# EAGLE design AHRS-v1.3 (EAGLE 5.06)

## Sheet 1 of 3
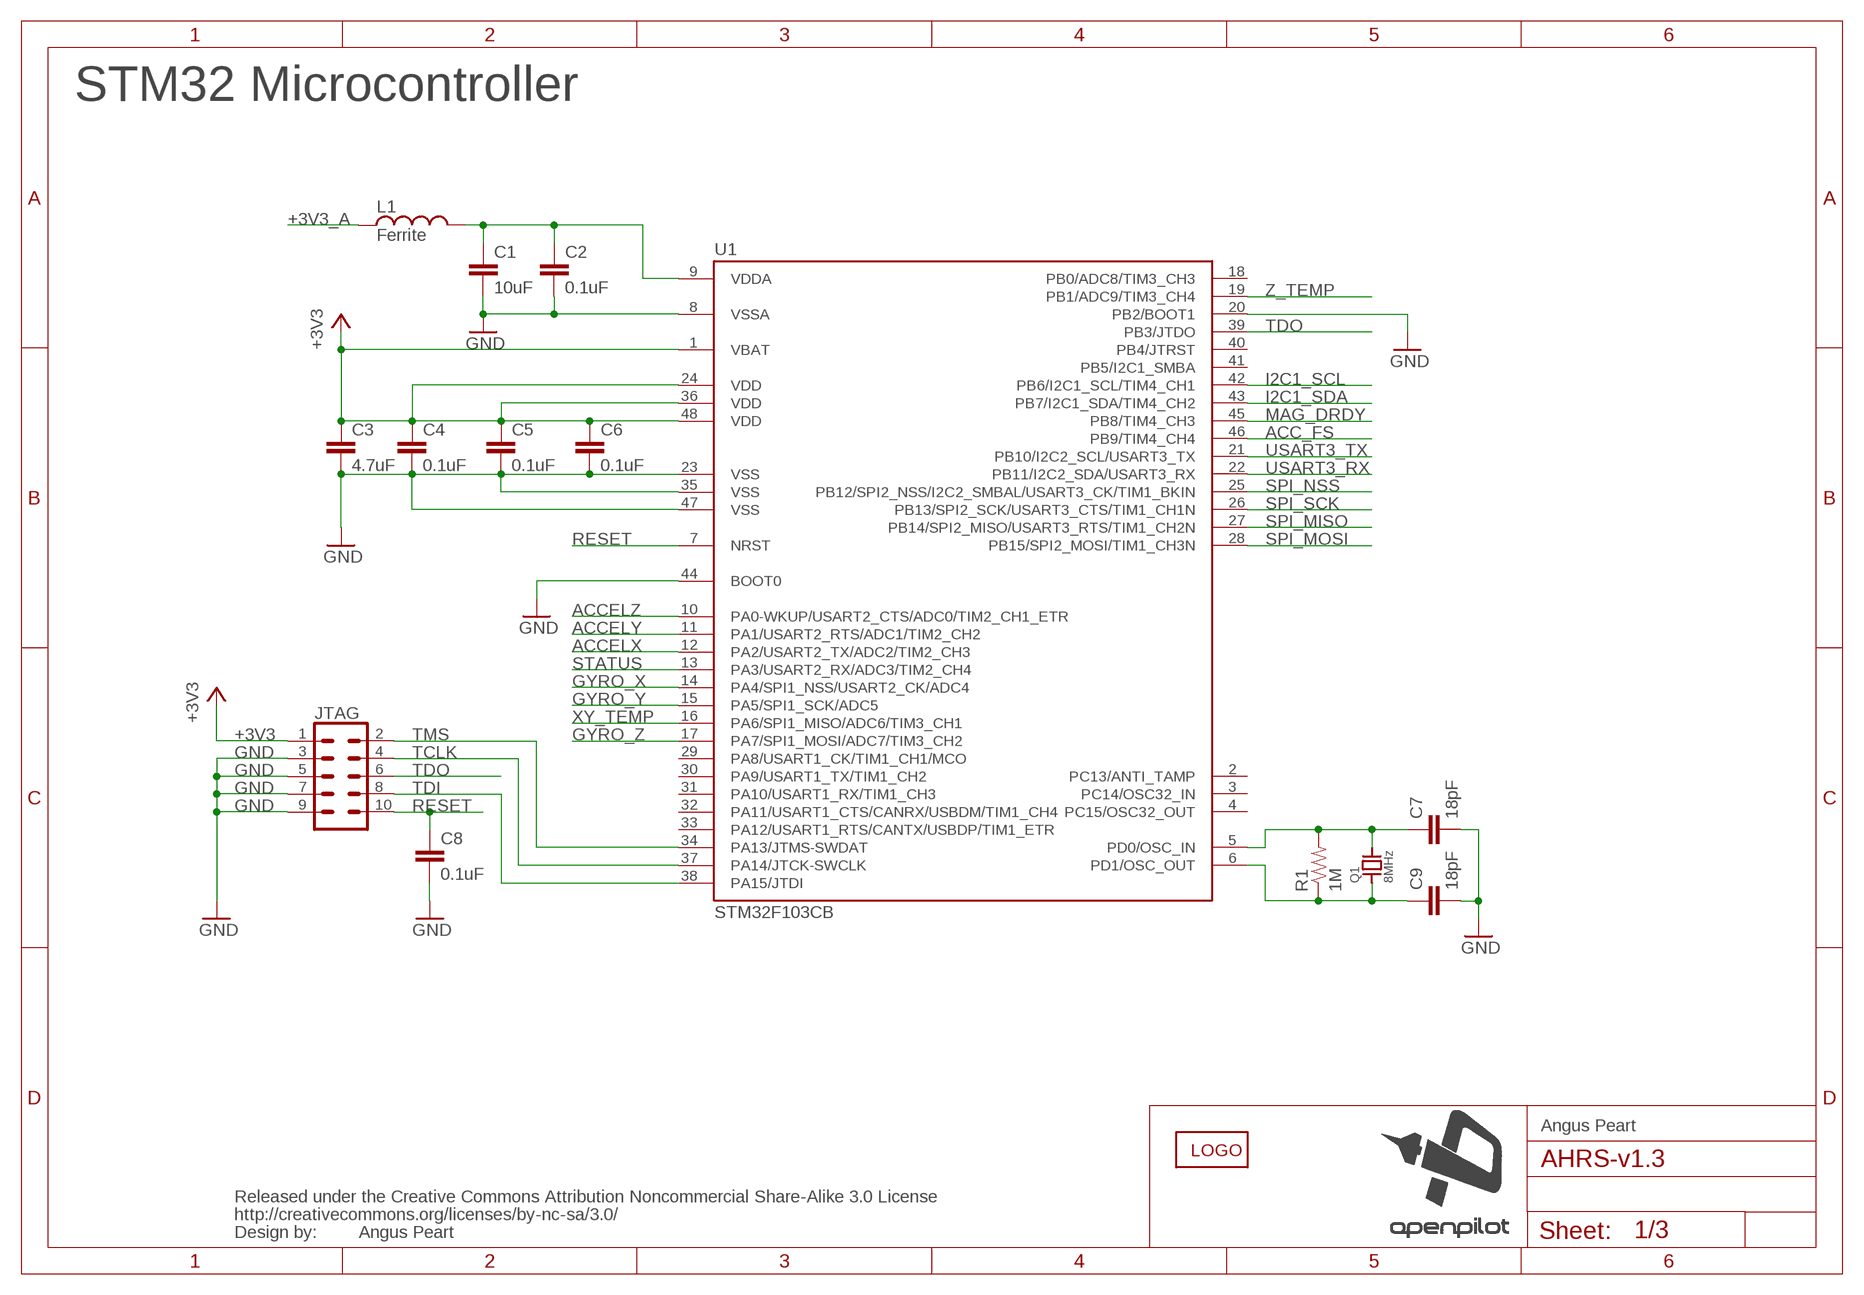
[diagram p0: schematic, sheet 1]

### Parts
C1  10uF  CAPACITOR0805  [0805]
C2  0.1uF  CAPACITOR0603  [0603]
C3  4.7uF  CAPACITOR0805  [0805]
C4  0.1uF  CAPACITOR0603  [0603]
C5  0.1uF  CAPACITOR0603  [0603]
C6  0.1uF  CAPACITOR0603  [0603]
C7  18pF  CAPACITOR0603  [0603]
C8  0.1uF  CAPACITOR0603  [0603]
C9  18pF  CAPACITOR0603  [0603]
CC1  CREATIVE_COMMONS  [CREATIVE_COMMONS]
JTAG  M50-10  [M50-10]
L1  Ferrite  INDUCTOR0603  [0603]
Q1  8MHz  CRYSTAL-5X3  [CRYSTAL-5X3]
R1  1M  RESISTOR0603  [0603]
U1  STM32F103CB  [LQFP48]
U$1  LOGO_BRD_AHRS-BOT  LOGO_BRD_AHRS_BOT  [LOGO-AHRS-BOT]

### Nets
+3V3: C3.1 C4.1 C5.1 C6.1 JTAG.1 U1.1(VBAT) U1.24(VDD) U1.36(VDD) U1.48(VDD) ; also sheet 2,3
+3V3_A: L1.1 ; also sheet 2,3
ACC_FS: U1.46(PB9/TIM4_CH4) ; also sheet 2
ACCELX: U1.12(PA2/USART2_TX/ADC2/TIM2_CH3) ; also sheet 2
ACCELY: U1.11(PA1/USART2_RTS/ADC1/TIM2_CH2) ; also sheet 2
ACCELZ: U1.10(PA0-WKUP/USART2_CTS/ADC0/TIM2_CH1_ETR) ; also sheet 2
GND: C1.2 C2.2 C3.2 C4.2 C5.2 C6.2 C7.2 C8.2 C9.2 JTAG.3 JTAG.5 JTAG.7 JTAG.9 U1.8(VSSA) U1.20(PB2/BOOT1) U1.23(VSS) U1.35(VSS) U1.44(BOOT0) U1.47(VSS) ; also sheet 2,3
GYRO_X: U1.14(PA4/SPI1_NSS/USART2_CK/ADC4) ; also sheet 2
GYRO_Y: U1.15(PA5/SPI1_SCK/ADC5) ; also sheet 2
GYRO_Z: U1.17(PA7/SPI1_MOSI/ADC7/TIM3_CH2) ; also sheet 2
I2C1_SCL: U1.42(PB6/I2C1_SCL/TIM4_CH1) ; also sheet 2
I2C1_SDA: U1.43(PB7/I2C1_SDA/TIM4_CH2) ; also sheet 2
MAG_DRDY: U1.45(PB8/TIM4_CH3) ; also sheet 2
N$4: C7.1 Q1.3 R1.2 U1.5(PD0/OSC_IN)
N$5: C9.1 Q1.1 R1.1 U1.6(PD1/OSC_OUT)
N$16: C1.1 C2.1 L1.2 U1.9(VDDA)
RESET: C8.1 JTAG.10 U1.7(NRST)
SPI_MISO: U1.27(PB14/SPI2_MISO/USART3_RTS/TIM1_CH2N) ; also sheet 3
SPI_MOSI: U1.28(PB15/SPI2_MOSI/TIM1_CH3N) ; also sheet 3
SPI_NSS: U1.25(PB12/SPI2_NSS/I2C2_SMBAL/USART3_CK/TIM1_BKIN) ; also sheet 3
SPI_SCK: U1.26(PB13/SPI2_SCK/USART3_CTS/TIM1_CH1N) ; also sheet 3
STATUS: U1.13(PA3/USART2_RX/ADC3/TIM2_CH4) ; also sheet 3
TCLK: JTAG.4 U1.37(PA14/JTCK-SWCLK)
TDI: JTAG.8 U1.38(PA15/JTDI)
TDO: JTAG.6 U1.39(PB3/JTDO)
TMS: JTAG.2 U1.34(PA13/JTMS-SWDAT)
USART3_RX: U1.22(PB11/I2C2_SDA/USART3_RX) ; also sheet 3
USART3_TX: U1.21(PB10/I2C2_SCL/USART3_TX) ; also sheet 3
XY_TEMP: U1.16(PA6/SPI1_MISO/ADC6/TIM3_CH1) ; also sheet 2
Z_TEMP: U1.19(PB1/ADC9/TIM3_CH4) ; also sheet 2
Unconnected: U1.2(PC13/ANTI_TAMP) U1.3(PC14/OSC32_IN) U1.4(PC15/OSC32_OUT) U1.18(PB0/ADC8/TIM3_CH3) U1.29(PA8/USART1_CK/TIM1_CH1/MCO) U1.30(PA9/USART1_TX/TIM1_CH2) U1.31(PA10/USART1_RX/TIM1_CH3) U1.32(PA11/USART1_CTS/CANRX/USBDM/TIM1_CH4) U1.33(PA12/USART1_RTS/CANTX/USBDP/TIM1_ETR) U1.40(PB4/JTRST) U1.41(PB5/I2C1_SMBA)

### Notes on the sheet
- STM32 Microcontroller
- Angus Peart
- Angus Peart

## Sheet 2 of 3
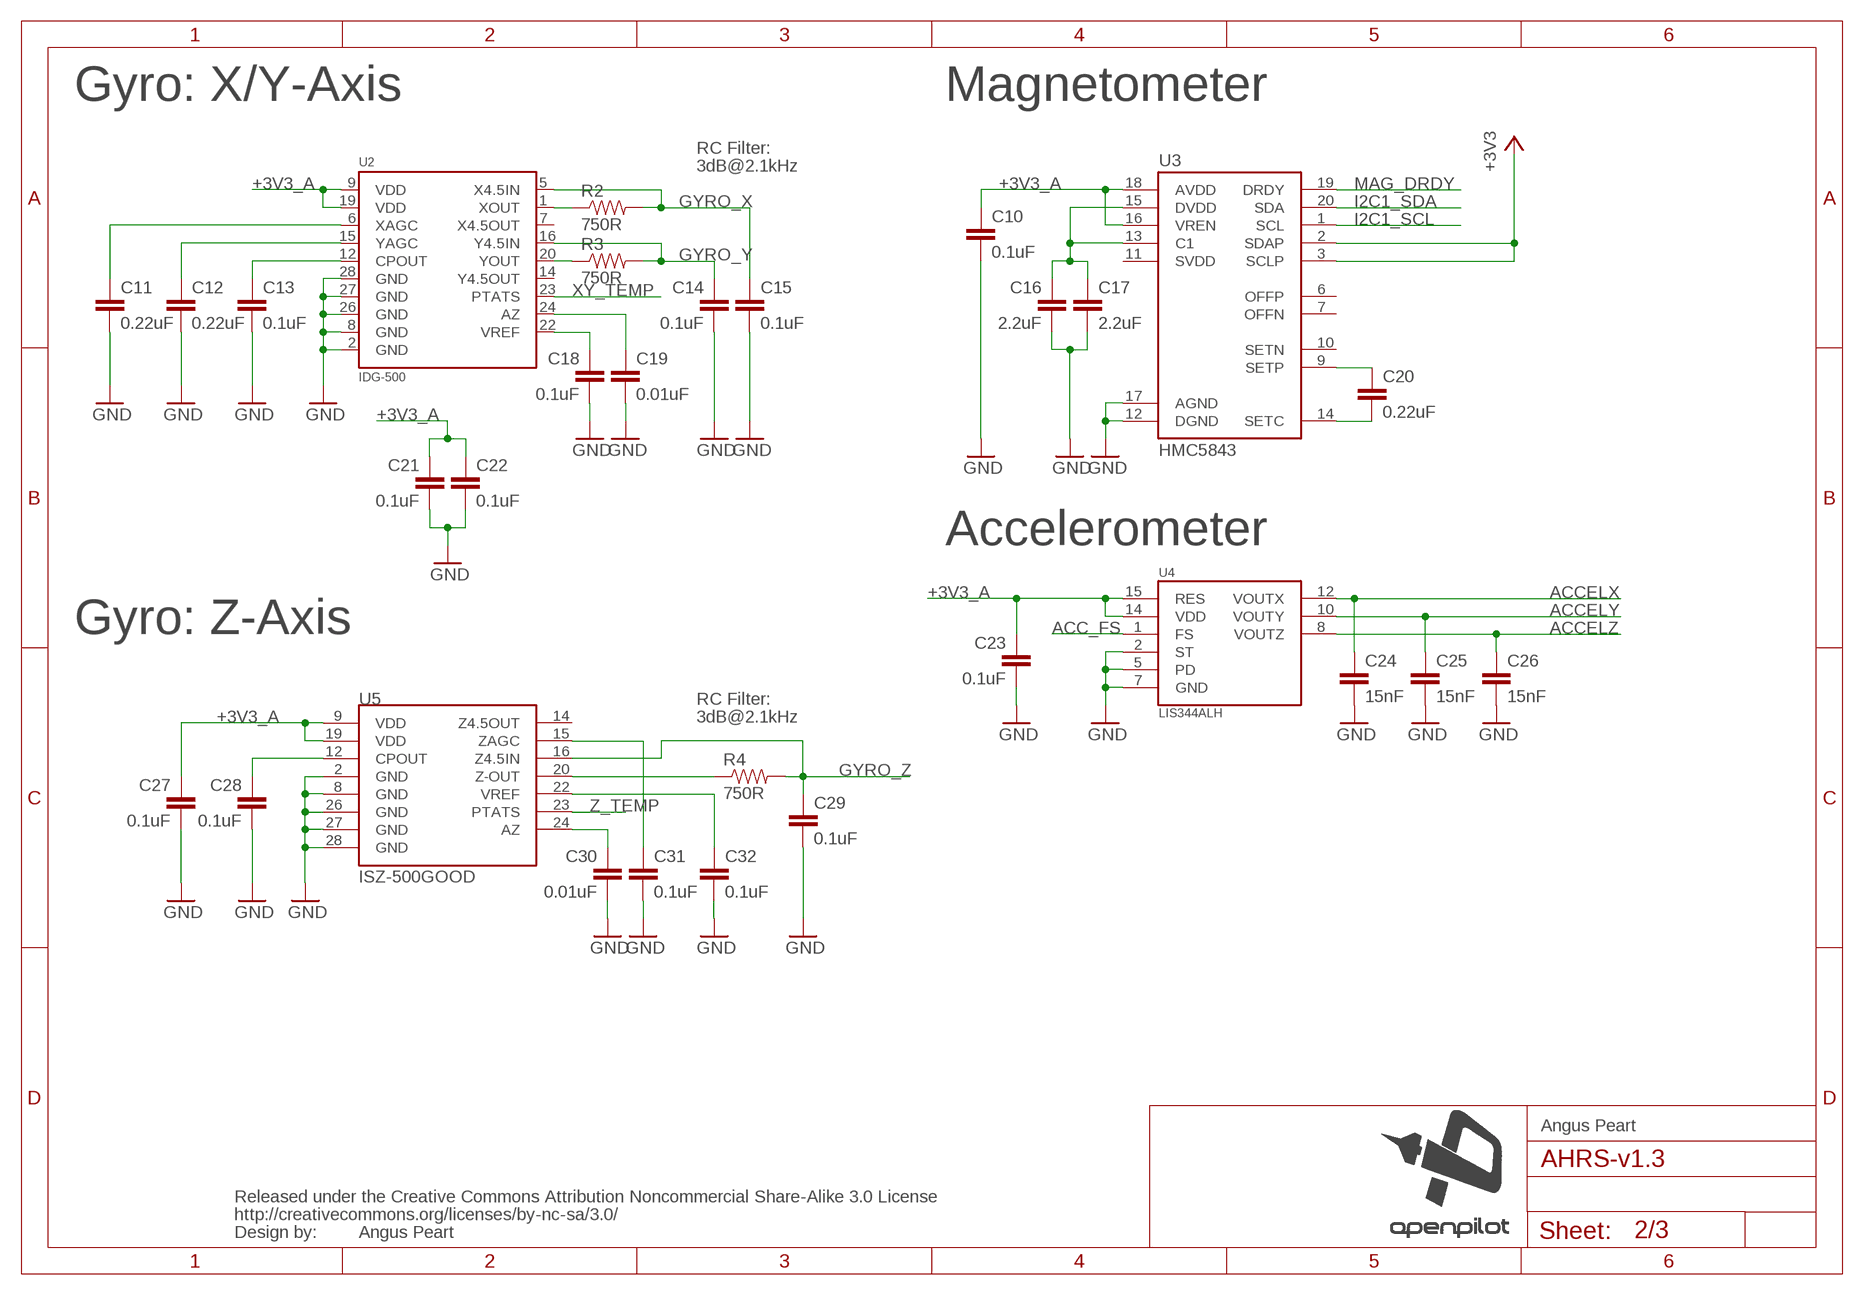
[diagram p1: schematic, sheet 2]

### Parts
C10  0.1uF  CAPACITOR0603  [0603]
C11  0.22uF  CAPACITOR0603  [0603]
C12  0.22uF  CAPACITOR0603  [0603]
C13  0.1uF  CAPACITOR0603  [0603]
C14  0.1uF  CAPACITOR0603  [0603]
C15  0.1uF  CAPACITOR0603  [0603]
C16  2.2uF  CAPACITOR0603  [0603]
C17  2.2uF  CAPACITOR0603  [0603]
C18  0.1uF  CAPACITOR0603  [0603]
C19  0.01uF  CAPACITOR0603  [0603]
C20  0.22uF  CAPACITOR0603  [0603]
C21  0.1uF  CAPACITOR0603  [0603]
C22  0.1uF  CAPACITOR0603  [0603]
C23  0.1uF  CAPACITOR0603  [0603]
C24  15nF  CAPACITOR0805  [0805]
C25  15nF  CAPACITOR0805  [0805]
C26  15nF  CAPACITOR0805  [0805]
C27  0.1uF  CAPACITOR0603  [0603]
C28  0.1uF  CAPACITOR0603  [0603]
C29  0.1uF  CAPACITOR0603  [0603]
C30  0.01uF  CAPACITOR0603  [0603]
C31  0.1uF  CAPACITOR0603  [0603]
C32  0.1uF  CAPACITOR0603  [0603]
CC2  CREATIVE_COMMONS  [CREATIVE_COMMONS]
R2  750R  RESISTOR0603  [0603]
R3  750R  RESISTOR0603  [0603]
R4  750R  RESISTOR0603  [0603]
U2  IDG-500  [IDG-500]
U3  HMC5843  [LPCC-20]
U4  LIS344ALH  [LGA-16L]
U5  ISZ-500GOOD  [IDG-500]

### Nets
+3V3: U3.2(SDAP) U3.3(SCLP) ; also sheet 1,3
+3V3_A: C10.1 C21.1 C22.1 C23.1 C27.1 U2.9(VDD) U2.19(VDD) U3.16(VREN) U3.18(AVDD) U4.14(VDD) U4.15(RES) U5.9(VDD) U5.19(VDD) ; also sheet 1,3
ACC_FS: U4.1(FS) ; also sheet 1
ACCELX: C24.1 U4.12(VOUTX) ; also sheet 1
ACCELY: C25.1 U4.10(VOUTY) ; also sheet 1
ACCELZ: C26.1 U4.8(VOUTZ) ; also sheet 1
GND: C10.2 C11.2 C12.2 C13.2 C14.2 C15.2 C16.2 C17.2 C18.2 C19.2 C21.2 C22.2 C23.2 C24.2 C25.2 C26.2 C27.2 C28.2 C29.2 C30.2 C31.2 C32.2 U2.2(GND) U2.8(GND) U2.26(GND) U2.27(GND) U2.28(GND) U3.12(DGND) U3.17(AGND) U4.2(ST) U4.5(PD) U4.7(GND) U5.2(GND) U5.8(GND) U5.26(GND) U5.27(GND) U5.28(GND) ; also sheet 1,3
GYRO_X: C15.1 R2.2 U2.5(X4.5IN) ; also sheet 1
GYRO_Y: C14.1 R3.2 U2.16(Y4.5IN) ; also sheet 1
GYRO_Z: C29.1 R4.2 U5.16(Z4.5IN) ; also sheet 1
I2C1_SCL: U3.1(SCL) ; also sheet 1
I2C1_SDA: U3.20(SDA) ; also sheet 1
MAG_DRDY: U3.19(DRDY) ; also sheet 1
N$1: C12.1 U2.15(YAGC)
N$3: C16.1 C17.1 U3.13(C1) U3.15(DVDD)
N$7: C28.1 U5.12(CPOUT)
N$8: C20.1 U3.9(SETP)
N$9: C11.1 U2.6(XAGC)
N$10: C13.1 U2.12(CPOUT)
N$11: C18.1 U2.22(VREF)
N$12: C19.1 U2.24(AZ)
N$13: C20.2 U3.14(SETC)
N$19: C30.1 U5.24(AZ)
N$20: R2.1 U2.1(XOUT)
N$21: C32.1 U5.22(VREF)
N$22: R3.1 U2.20(YOUT)
N$23: R4.1 U5.20(Z-OUT)
N$25: C31.1 U5.15(ZAGC)
XY_TEMP: U2.23(PTATS) ; also sheet 1
Z_TEMP: U5.23(PTATS) ; also sheet 1
Unconnected: U2.7(X4.5OUT) U2.14(Y4.5OUT) U3.6(OFFP) U3.7(OFFN) U3.10(SETN) U3.11(SVDD) U5.14(Z4.5OUT)

### Notes on the sheet
- Gyro: X/Y-Axis | Magnetometer
- RC Filter:
- 3dB@2.1kHz
- Accelerometer
- Gyro: Z-Axis
- RC Filter:
- 3dB@2.1kHz
- Angus Peart
- Angus Peart

## Sheet 3 of 3
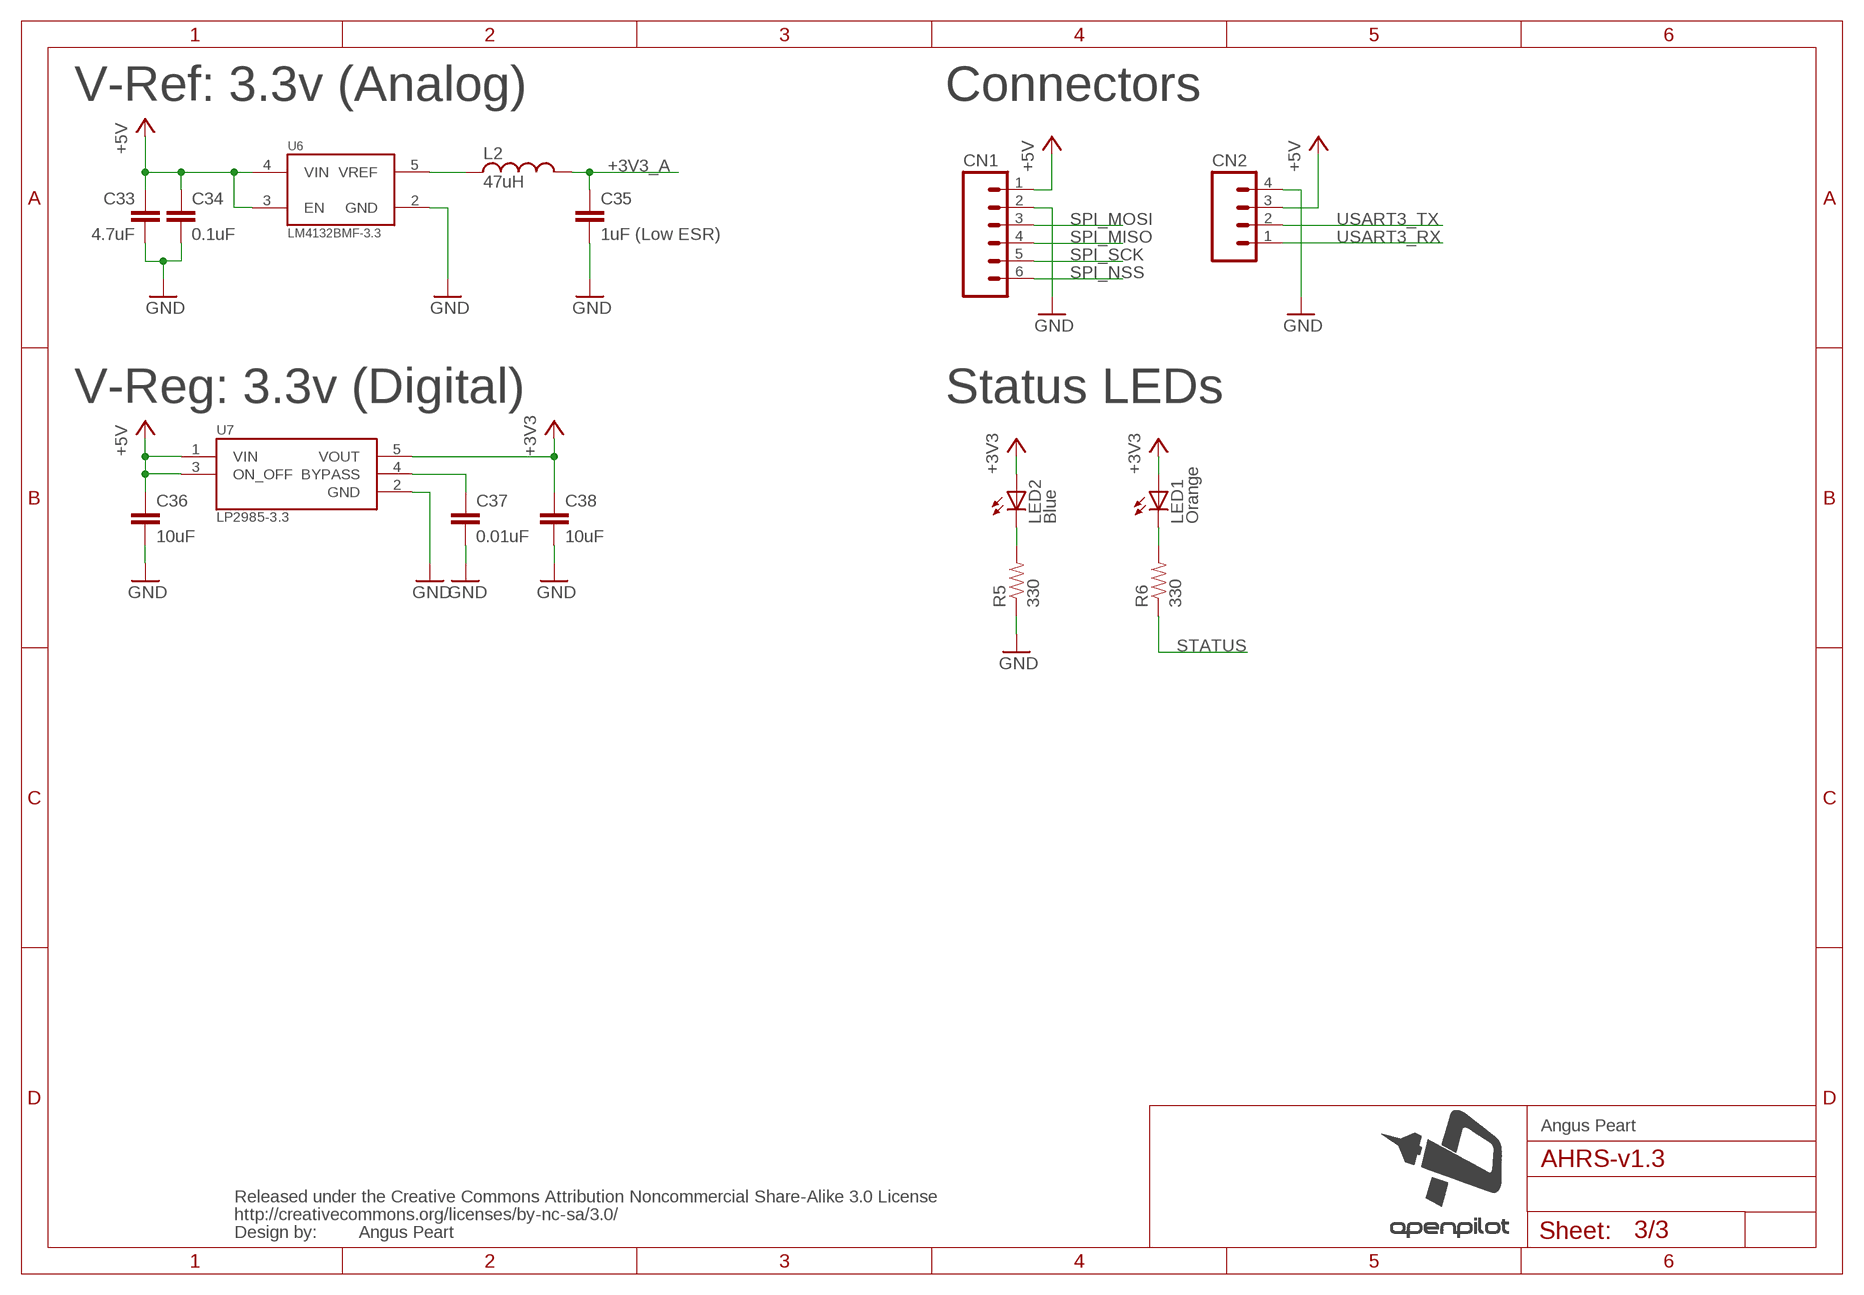
[diagram p2: schematic, sheet 3]

### Parts
C33  4.7uF  CAPACITOR0805  [0805]
C34  0.1uF  CAPACITOR0603  [0603]
C35  1uF (Low ESR)  CAPACITOR0603  [0603]
C36  10uF  CAPACITOR0805  [0805]
C37  0.01uF  CAPACITOR0603  [0603]
C38  10uF  CAPACITOR0805  [0805]
CC3  CREATIVE_COMMONS  [CREATIVE_COMMONS]
CN1  SM06B-SRSS-TB  [SM06B-SRSS-TB]
CN2  M04PTH  [1X04]
L2  47uH  INDUCTOR0603  [0603]
LED1  Orange  LED0603  [LED-0603]
LED2  Blue  LED0603  [LED-0603]
R5  330  RESISTOR0603  [0603]
R6  330  RESISTOR0603  [0603]
U6  LM4132BMF-3.3  LM4132  [SOT-23-5]
U7  LP2985-3.3  LP2985  [SOT-23-5]

### Nets
+3V3: C38.1 LED1.A LED2.A U7.5(VOUT) ; also sheet 1,2
+3V3_A: C35.1 L2.2 ; also sheet 1,2
+5V: C33.1 C34.1 C36.1 CN1.1 CN2.3 U6.3(EN) U6.4(VIN) U7.1(VIN) U7.3(ON_OFF)
GND: C33.2 C34.2 C35.2 C36.2 C37.2 C38.2 CN1.2 CN2.4 R5.1 U6.2(GND) U7.2(GND) ; also sheet 1,2
N$2: C37.1 U7.4(BYPASS)
N$6: LED1.C R6.2
N$14: LED2.C R5.2
N$18: L2.1 U6.5(VREF)
SPI_MISO: CN1.4 ; also sheet 1
SPI_MOSI: CN1.3 ; also sheet 1
SPI_NSS: CN1.6 ; also sheet 1
SPI_SCK: CN1.5 ; also sheet 1
STATUS: R6.1 ; also sheet 1
USART3_RX: CN2.1 ; also sheet 1
USART3_TX: CN2.2 ; also sheet 1

### Notes on the sheet
- V-Ref: 3.3v (Analog) | Connectors
- V-Reg: 3.3v (Digital) | Status LEDs
- Angus Peart
- Angus Peart

## Library data of the parts
C1-C38 = OpenPilot:CAPACITOR: Capacitor Standard SMD ceramic capacitors.
CC1-CC3 = OpenPilot:CREATIVE_COMMONS: Creative Commons Licenses http://creativecommons.org/licenses/
CN1 = OpenPilot:SM06B-SRSS-TB: JST SR Connector 6 pins, SMT (Side entry)
CN2 = SparkFun:M04: Header 4 Standard 4-pin 0.1" header. Use with straight break away headers (SKU : PRT-00116), right angle break away headers (PRT-00553), swiss pins (PRT-00743), machine pins (PRT-00117), and female headers (PRT-00115). Molex polarized connector foot print use with SKU : PRT-08231 with associated crimp pins and housings.
JTAG = OpenPilot:M50-10
L1 L2 = OpenPilot:INDUCTOR
LED1 LED2 = OpenPilot:LED: Standard packages for surface mount Light Emitting Diodes (LEDs).
Q1 = OpenPilot:CRYSTAL: 5x3 Part: Digikey part: CTX639CT-ND or 535-9720-1-ND
R1-R6 = OpenPilot:RESISTOR: Resistor Basic schematic elements and footprints for 0603 resistors.
U1 = OpenPilot:STM32F103C: ST Microelectronics STM32 Device: STM32F103Cx Package: 48LQFP
U2 = OpenPilot:IDG-500: Invensense IDG-500 Dual Axis Gyro 500°/s or 110°/s output
U3 = OpenPilot:HMC5843: Honeywell HMC5843 3-Axis Digital Compass IC
U4 = OpenPilot:LIS344ALH: ST Microelectronics LIS344ALH High performance 3-axis ±2/±6g ultracompact linear accelerometer
U5 = OpenPilot:ISZ-500: Invensense ISZ500 Single axis gyro 500°/s or 110°/s output
U6 = OpenPilot:LM4132: National Semiconductor LM4132 SOT-23 Precision Low Dropout Voltage Reference
U7 = OpenPilot:LP2985: National Semiconductor LP2985 Micropower 150 mA Low-Noise Ultra Low-Dropout Regulator in SOT-23 and micro SMD Packages
U$1 = OpenPilot:LOGO_BRD: Various logos used in the OpenPilot PCB designs.

## Board
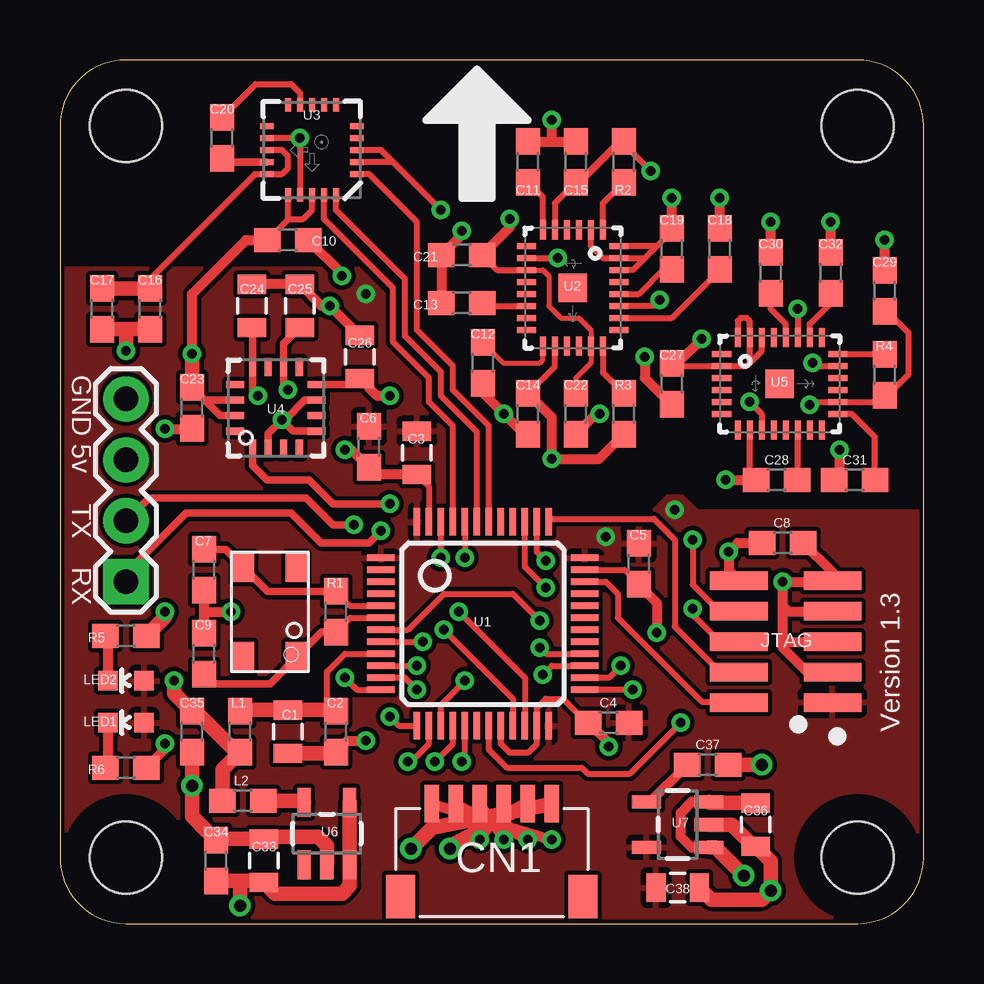
[diagram p3: board, top side]
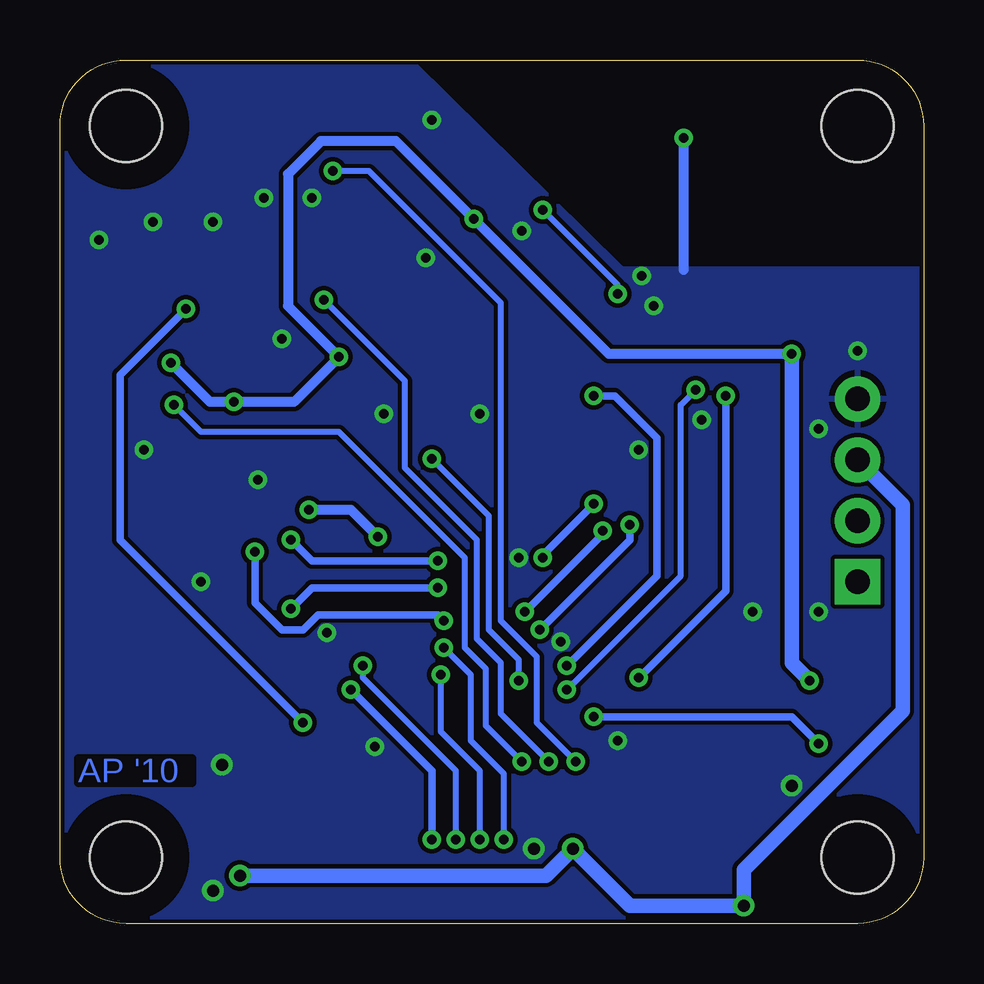
[diagram p4: board, bottom side, seen from below]

Size 36 x 36 mm. Coordinates in mm from the lower left corner, seen from the top.
Outline: 0,2.75 arc90 2.75,0 33.25,0 arc90 36,2.75 36,33.25 arc90 33.25,36 2.75,36 arc90 0,33.25 0,2.75
Copper layers (1*16): Top 0.0356mm / dielectric 1.5011mm / Bottom 0.0356mm
Design rules "7mils GUS Engineering *": minimum track width 7mil, minimum drill 15mil, track to track 7mil, track to pad 7mil, pad to pad 7mil, via to via 7mil, smd to smd 7mil, copper to edge 7mil, drill to drill 7mil, minimum pad ring 10mil, minimum via ring 8mil, stop-mask expansion 4mil, vias tented up to drill 25mil, thermal gap 10mil
Holes 3 mm at 2.75,2.75 2.75,33.25 33.25,33.25 33.25,2.75
tRestrict: area 30.8,0.2 to 35.8,5.2; area 0.2,0.2 to 5.2,5.2; area 0,17.2 to 36,36
bRestrict: area 0,27.5 to 21.1,36; area 0.2,0.2 to 5.2,5.2; area 30.8,0.2 to 35.8,5.2; area 30.8,30.8 to 35.8,35.8

### Footprints (pad centres in the part's own frame; a part is rotated, then mirrored left to right if it is on the bottom)
0805 = smd 0.8 x 1.2: 1 -0.9,0; 2 0.9,0
0603 = smd 1.1 x 1: 1 -0.85,0; 2 0.85,0
SM06B-SRSS-TB = smd 0.6 x 1.55: 1 5,0; 2 4,0; 3 3,0; 4 2,0; 5 1,0; 6 0,0 | smd 1.2 x 1.8: NC@1 -1.3,-3.875; NC@2 6.3,-3.875
1X04 = drill 1.016 pad 1.88 square: 1 0,0 | drill 1.016 pad 1.88 round: 2 2.54,0; 3 5.08,0; 4 7.62,0
M50-10 = smd 0.76 x 2.4: 1 -2.54,-1.95; 2 -2.54,1.95; 3 -1.27,-1.95; 4 -1.27,1.95; 5 0,-1.95; 6 0,1.95; 7 1.27,-1.95; 8 1.27,1.95; 9 2.54,-1.95; 10 2.54,1.95
LED-0603 = smd 0.8 x 0.8: A 0,-0.75; C 0,0.75
CRYSTAL-5X3 = smd 1.2 x 0.9: 1 1.85,1.1; 2 -1.85,1.1; 3 -1.85,-1.1; 4 1.85,-1.1
LQFP48 = smd 1.143 x 0.254: 1 -4.25,2.75; 2 -4.25,2.25; 3 -4.25,1.75; 4 -4.25,1.25; 5 -4.25,0.75; 6 -4.25,0.25; 7 -4.25,-0.25; 8 -4.25,-0.75; 9 -4.25,-1.25; 10 -4.25,-1.75; 11 -4.25,-2.25; 12 -4.25,-2.75; 25 4.25,-2.75; 26 4.25,-2.25; 27 4.25,-1.75; 28 4.25,-1.25; 29 4.25,-0.75; 30 4.25,-0.25; 31 4.25,0.25; 32 4.25,0.75; 33 4.25,1.25; 34 4.25,1.75; 35 4.25,2.25; 36 4.25,2.75 | smd 0.254 x 1.143: 13 -2.75,-4.25; 14 -2.25,-4.25; 15 -1.75,-4.25; 16 -1.25,-4.25; 17 -0.75,-4.25; 18 -0.25,-4.25; 19 0.25,-4.25; 20 0.75,-4.25; 21 1.25,-4.25; 22 1.75,-4.25; 23 2.25,-4.25; 24 2.75,-4.25; 37 2.75,4.25; 38 2.25,4.25; 39 1.75,4.25; 40 1.25,4.25; 41 0.75,4.25; 42 0.25,4.25; 43 -0.25,4.25; 44 -0.75,4.25; 45 -1.25,4.25; 46 -1.75,4.25; 47 -2.25,4.25; 48 -2.75,4.25
IDG-500 = smd 0.8 x 0.25: 1 -2.417,1.25; 2 -2.417,0.75; 3 -2.417,0.25; 4 -2.417,-0.25; 5 -2.417,-0.75; 6 -2.417,-1.25; 15 2.433,-1.25; 16 2.433,-0.75; 17 2.433,-0.25; 18 2.433,0.25; 19 2.433,0.75; 20 2.433,1.25 | smd 0.25 x 0.8: 7 -1.75,-1.925; 8 -1.25,-1.925; 9 -0.75,-1.925; 10 -0.25,-1.925; 11 0.25,-1.925; 12 0.75,-1.925; 13 1.25,-1.925; 14 1.75,-1.925; 21 1.75,1.925; 22 1.25,1.925; 23 0.75,1.925; 24 0.25,1.925; 25 -0.25,1.925; 26 -0.75,1.925; 27 -1.25,1.925; 28 -1.75,1.925 | smd 1.2 x 1.2: NC 0,0
LPCC-20 = smd 0.25 x 0.56: 1 1,1.88; 2 0.5,1.88; 3 0,1.88; 4 -0.5,1.88; 5 -1,1.88; 11 -1,-1.88; 12 -0.5,-1.88; 13 0,-1.88; 14 0.5,-1.88; 15 1,-1.88 | smd 0.56 x 0.25: 6 -1.88,1; 7 -1.88,0.5; 8 -1.88,0; 9 -1.88,-0.5; 10 -1.88,-1; 16 1.88,-1; 17 1.88,-0.5; 18 1.88,0; 19 1.88,0.5; 20 1.88,1
LGA-16L = smd 0.75 x 0.3: 1 -1.7,0.975; 2 -1.7,0.325; 3 -1.7,-0.325; 4 -1.7,-0.975; 9 1.7,-0.975; 10 1.7,-0.325; 11 1.7,0.325; 12 1.7,0.975 | smd 0.3 x 0.75: 5 -0.975,-1.7; 6 -0.325,-1.7; 7 0.325,-1.7; 8 0.975,-1.7; 13 0.975,1.7; 14 0.325,1.7; 15 -0.325,1.7; 16 -0.975,1.7
SOT-23-5 = smd 0.55 x 1.2: 1 -0.95,-1.3; 2 0,-1.3; 3 0.95,-1.3; 4 0.95,1.3; 5 -0.95,1.3

### Placement (x,y rotation side)
C1  9.5,8 270 top
C2  11.5,8 270 top
C3  14.88,19.62 270 top
C4  22.88,8.38 180 top
C5  24.12,15 270 top
C6  12.88,19.88 270 top
C7  6,14.75 270 top
C8  30.12,15.88 0 top
C9  6,11.25 90 top
C10  9.5,28.5 0 top
C11  19.5,31.75 90 top
C12  17.62,23.38 270 top
C13  16.75,25.88 180 top
C14  19.5,21.25 270 top
C15  21.5,31.75 90 top
C16  3.75,25.62 270 top
C17  1.75,25.62 270 top
C18  27.5,28.12 90 top
C19  25.5,28.12 90 top
C20  6.75,32.75 270 top
C21  16.75,27.88 180 top
C22  21.5,21.25 270 top
C23  5.5,21.5 270 top
C24  8,25.75 90 top
C25  10,25.75 90 top
C26  12.5,23.62 90 top
C27  25.5,22.5 90 top
C28  29.88,18.5 180 top
C29  34.38,26.38 90 top
C30  29.62,27.12 90 top
C31  33.12,18.5 180 top
C32  32.12,27.12 90 top
C33  8.5,2.62 90 top
C34  6.5,2.62 90 top
C35  5.5,8 270 top
C36  29,4.12 270 top
C37  27,6.62 0 top
C38  25.75,1.5 0 top
CC1  -71.88,-8.5 0 top  (outside the outline)
CC2  58.5,-17 0 top  (outside the outline)
CC3  58.5,-25.5 0 top  (outside the outline)
CN1  15.5,5 0 top
CN2  2.75,14.25 90 top
JTAG  30.25,11.75 90 top
L1  7.5,8 90 top
L2  7.62,5.12 180 top
LED1  2.75,8.38 90 top
LED2  2.75,10.12 90 top
Q1  8.75,13 270 top
R1  11.5,13 90 top
R2  23.5,31.75 90 top
R3  23.5,21.25 270 top
R4  34.38,22.88 270 top
R5  2.75,12 180 top
R6  2.75,6.5 180 top
U1  17.62,12.5 0 top
U2  21.38,26.5 270 top
U3  10.5,32.25 270 top
U4  9,21.5 90 top
U5  30,22.5 0 top
U6  11.12,3.75 0 top
U7  25.75,4.12 90 top
U$1  28.25,5.75 0 bottom

### Tracks (layer width: path | path; a pad name or v marks a point on that pad's centre or on a via)
+3V3  (via drill 0.38)
  Top 0.254: 13.88,31.75 U3.2 | v15.88,29.75 13.88,31.75 | U3.3 13.38,32.25 13.88,31.75
  Bottom 0.254: v15.88,29.75 12.75,26.62 v12.75,26.25
  Bottom 0.406: v25.62,17.25 23.88,17.25 v22.75,16.12
  pour Top: 0,0 0,36 36,36 36,0
+3V3_A  (via drill 0.38)
  Top 0.203: U2.9 20.12,27.25 20.38,27 20.38,25.75 20.88,25.25 21.62,25.25 22.12,24.75 U2.19 22.12,23.38 21.5,22.75 C22.1
  Top 0.254: 9.5,29.35 U3.16 | C10.1 9.5,29.35 | U3.18 10.5,29.75 10.12,29.38 9.53,29.38 9.5,29.35 | U2.9 18.23,27.25 C21.1 | U5.9 29.25,21.25 v28.75,21.75 | U5.19 31.5,23.25 v31.38,23.38
  Top 0.305: U4.15 6.67,21.18 5.92,21.93 | C23.1 5.92,21.93 | U4.14 6.03,21.82 5.92,21.93
  Top 0.406: C21.1 18.75,29.02 v18.75,29.38 | v24.38,23.62 24.38,22.75 25.48,21.65 C27.1 | v5.5,23.75 5.5,26.25 7.75,28.5 C10.1
  Top 0.61: 5.4,22.25 C23.1 v5.5,23.75 | v4.75,10.12 4.75,9.6 C35.1 5.65,8.85 7.35,7.15 L1.1 6.78,6.42 L2.2
  Bottom 0.406: v5.5,23.75 13.12,23.75 v18.75,29.38 22,32.62 25.12,32.62 26.5,31.25 26.5,25.75 v24.38,23.62 26.25,21.75 v28.75,21.75 29.75,21.75 v31.38,23.38
  Bottom 0.61: v5.5,23.75 5.5,10.88 v4.75,10.12
+5V  (via drill 0.5)
  Top 0.406: U7.3 26.32,5.08 25.88,4.62 25.88,3.62 26.32,3.17 U7.1
  Top 0.61: C36.1 27.1,5.03 U7.3 | v28.5,2 27.32,3.17 U7.1 | v14.62,3.12 15.5,4 CN1.1 | C34.1 7.5,1.77 | U6.4 U6.3 12.07,1.57 11.75,1.25 8.97,1.25 C33.1 8.45,1.77 7.5,1.77 | 7.5,1.77 v7.5,0.75
  Bottom 0.61: v28.5,2 15.75,2 v14.62,3.12 12.25,0.75 v7.5,0.75 7.5,2.25 0.88,8.88 0.88,17.45 CN2.3
ACC_FS  (via drill 0.38)
  Top 0.254: v15.88,15.25 U1.46
  Top 0.305: U4.1 8.03,19.1 8.62,18.5 10.38,18.5 11.38,17.5 v13.75,17.5
  Bottom 0.305: v13.75,17.5 15.88,15.38 v15.88,15.25
ACCELX  (via drill 0.38)
  Top 0.254: U1.12 12.38,9.75 v11.88,10.25
  Top 0.305: v8.25,22 8.03,22.23 U4.12 8.03,24.82 C24.1
  Bottom 0.305: v8.25,22 8.25,13.88 v11.88,10.25
ACCELY  (via drill 0.38)
  Top 0.254: U1.11 14.38,10.25 v14.88,9.75
  Top 0.305: v9.5,22.25 9.32,22.43 U4.10 9.32,24.18 C25.1
  Bottom 0.254: v9.5,22.25 10.12,21.62 10.12,14.5 v14.88,9.75
ACCELZ  (via drill 0.38)
  Top 0.254: U1.10 v14.88,10.75
  Top 0.305: U4.8 12.25,22.48 C26.1
  Top 0.406: C26.1 13.22,22 v13.75,22
  Bottom 0.305: v13.75,22 12.88,22 11.12,20.25 11.12,14.5 v14.88,10.75
GND  (via drill 0.38, 0.5)
  Top 0.254: JTAG.7 32.18,13 | 32.16,14.25 JTAG.9 | U3.12 v10,32.75 U3.17 | U1.44 v16.88,15.25 | U1.8 v15.12,11.75 | U1.35 23.52,14.75 C5.2 | C4.2 21.98,8.38 20.98,9.38 20.25,9.38 19.88,9 U1.23 19.88,7.5 19.5,7.12 18.75,7.12 18.38,7.5 U1.20 | U1.47 15.38,18.23 C3.2 | 28.75,23.38 29.25,23.88 U5.26 | 28.76,18.77 C28.2 28.75,18.77 U5.8 | U2.8 v20.75,27.75 | U2.2 22.12,28.25 22.62,27.75 U2.27 24.38,27.75 | C19.2 25.37,28.98 | U2.26 23.88,27.25 24.38,27.75 | 24.38,27.75 24.88,28.25 | 24.88,28.25 25.38,28.75 | 24.88,28.25 U2.28 | C27.2 25.6,23.25 U5.2 28.62,23.25 28.75,23.38 | 28.75,23.38 U5.27 28.75,25.12 28.62,25.25 28.38,25.25 28.25,25.12 U5.28
  Top 0.305: U4.2 8.68,20.43 v9.25,21 | U4.5 9.72,20.52 v9.25,21 | U4.7 10.2,21.82 9.38,21 v9.25,21
  Top 0.406: 32.16,14.25 v30.12,14.25 30.12,13.25 | C9.2 6,13 | 6,13 v7.12,13 | 6,13 C7.2 | C24.2 C25.2 10.9,25.75 v11.25,25.75 12.47,24.52 C26.2 | 5.5,20.5 C23.2 5.5,20.62 v4.38,20.62 | C2.2 11.97,7.62 v12.75,7.62 | 32.18,10.5 31.25,10.5 | 32.18,10.5 JTAG.3 | 32.18,10.5 31.12,10.5 30.12,11.5 30.12,12 | 30.12,12 30.12,13.25 | JTAG.5 30.38,11.75 30.12,12 | JTAG.7 30.36,13.02 30.12,13.25 | C5.2 24.12,14.12 24.88,13.38 v24.88,12.12 | C4.2 22.88,7.53 v22.88,7.38 | v27.75,18.5 C28.2 | v16.75,28.88 16.75,28.73 C21.2 C13.2 | v22.5,21.25 22.35,21.25 C22.2 | C14.2 19.35,20.4 v18.5,21.25 17.62,22.12 C12.2 | C31.2 32.5,18.73 v32.5,19.75 | C29.2 v34.38,28.5 | C32.2 v32.12,29.25 | C30.2 v29.62,29.25 | C27.2 25.73,23.35 v26.75,24.38 | 25.38,28.75 25.38,28.85 C19.2 v25.5,30.25 | C11.2 20.5,32.6 | 20.5,32.6 C15.2 | 20.5,32.6 v20.5,33.5 | C8.2 32.2,14.65 JTAG.9 | C10.2 11.75,27.1 v11.75,27 | v11.88,19.75 12.15,19.75 C6.2 13.15,18.75 14.85,18.75 C3.2 | C18.2 v27.5,30.25
  Top 0.61: U7.2 28,4.12 28.9,3.23 C36.2 29.62,2.6 v29.62,1.38 29.25,1 27.15,1 C38.2 | CN1.2 16.5,3.38 v16.25,3.12 | C2.2 11.45,7.1 C1.2 | C17.2 2.75,24.77 | 2.75,24.77 C16.2 | 2.75,24.77 v2.75,23.88 | C34.2 6.65,3.62 | U6.2 11.12,3.25 10.75,3.62 8.6,3.62 C33.2 6.55,3.52 C34.2 | R5.1 4.38,12.78 v4.38,13 | C35.2 v5.5,5.75 5.5,4.47 C34.2 | C37.2 v29.25,6.62 | C34.2 5.85,4.12
  Bottom 0.406: 10,27.25 v10,32.75
  pour Bottom: 0,0 0,36 36,36 36,0
GYRO_X  (via drill 0.38)
  Top 0.254: R2.2 23.48,32.6 | v14.5,6.75 14.62,6.75 15.38,7.5 U1.14 | v24.62,31.38 23.5,32.5 R2.2 | U2.5 20.62,30.02 C15.1 21.77,30.9 21.77,31.02 | R2.2 23.35,32.6
  Top 0.305: 23.35,32.6 21.77,31.02
  Bottom 0.254: v14.5,6.75 16.12,8.38 16.12,11.12 17.62,12.62 17.62,25.88 23.12,31.38 v24.62,31.38
GYRO_Y  (via drill 0.38)
  Top 0.254: U2.16 20.62,23.23 C14.1 | v16.88,10.12 15.88,9.12 U1.15
  Top 0.406: C14.1 20.5,21.1 v20.5,19.38 22.48,19.38 R3.2
  Bottom 0.254: v16.88,10.12 16.88,11 18.12,12.25 18.12,17 v20.5,19.38
GYRO_Z  (via drill 0.38)
  Top 0.254: R4.2 34.15,22.02 | U1.17 16.88,6.88 v16.75,6.75 | R4.2 34.5,22.02 35.38,22.9 35.38,24.62 34.48,25.52 C29.1 | v31.25,21.62 31.38,21.75 U5.16 34.1,21.75 R4.2
  Bottom 0.254: v16.75,6.75 18.25,8.25 18.25,10.62 19.12,11.5 19.12,15.25 24.38,20.5 30.12,20.5 v31.25,21.62
I2C1_SCL
  Top 0.254: U3.1 12.88,31.25 14.88,29.25 14.88,24.75 16.38,23.25 16.38,22.25 17.88,20.75 U1.42
I2C1_SDA
  Top 0.254: U3.20 11.5,29.75 14.38,26.88 14.38,24.5 15.88,23 15.88,22 17.38,20.5 U1.43
MAG_DRDY
  Top 0.254: U1.45 16.38,20.75 15.38,21.75 15.38,22.75 13.88,24.25 13.88,26.5 11,29.38 U3.19
N$1
  Top 0.203: U2.15 20.12,23.5 20,23.38 18.48,23.38 C12.1
N$2
  Top 0.406: U7.4 24.6,5.08 C37.1
N$3
  Top 0.254: U3.13 9.25,32.25 9.5,32 9.5,31.5 9.25,31.25 U3.15 8.12,31.25 3.75,26.88 C16.1
  Top 0.305: C17.1 1.75,26.62
  Top 0.61: C17.1 C16.1
N$4
  Top 0.254: R1.2 12.1,13.25 U1.5
  Top 0.305: R1.2 8.65,13.85 Q1.3 6.9,15.6 C7.1
N$5
  Top 0.254: 9.9,11.15 Q1.1 | R1.1 12.1,12.75 U1.6
  Top 0.305: C9.1 6.4,10 8.75,10 9.9,11.15 10.9,12.15 R1.1
N$6
  Top 0.406: LED1.C 2,6.6 R6.2
N$7
  Top 0.254: 30.76,18.53 C28.1 30.75,18.52 U5.12
N$8
  Top 0.254: C20.1 8.15,35 9.62,35 10,34.62 U3.9
N$9
  Top 0.254: C11.1 20.12,30.27 U2.6
N$10
  Top 0.254: U2.12 17.6,25.75 C13.1
N$11
  Top 0.254: U2.22 25.5,25.25 27.5,27.25 C18.1
N$12
  Top 0.254: U2.24 24.12,26.25 25.15,27.27 C19.1
N$13
  Top 0.305: U3.14 6.9,31.75 C20.2
N$14
  Top 0.406: LED2.C 2,11.9 R5.2
N$16
  Top 0.254: U1.9 11.88,11.25 11.12,10.5 11.12,9.22 C2.1
  Top 0.305: C2.1 11.5,8.75
  Top 0.61: C2.1 11.45,8.9 C1.1 7.55,8.9 L1.2
N$18
  Top 0.61: L2.1 10.1,5.12 U6.5
N$19
  Top 0.254: C30.1 29.62,25.62 30.25,25 U5.24
N$20
  Top 0.254: U2.1 22.62,30.02 R2.1
N$21
  Top 0.254: C32.1 32.12,25.88 31.25,25 U5.22
N$22
  Top 0.254: U2.20 22.62,22.98 R3.1
N$23
  Top 0.254: U5.20 34.35,23.75 R4.1
N$25
  Top 0.254: C31.1 33.98,20.27 33,21.25 U5.15
RESET  (via drill 0.38)
  Top 0.254: U1.7 14.5,12.25 16,13.75 18.88,13.75 v20,12.62
  Top 0.406: C8.1 28.25,15.88 v27.88,15.5 27.88,14.71 JTAG.10
  Bottom 0.305: v20,12.62 20.25,12.88 25.25,12.88 25.88,12.25 26.75,12.25 27.88,13.38 v27.88,15.5
SPI_MISO  (via drill 0.38)
  Top 0.254: U1.27 20.5,10.75 v20.12,10.38
  Top 0.406: CN1.4 v18.5,3.5
  Bottom 0.254: v20.12,10.38 20.12,8 18.5,6.38 v18.5,3.5
SPI_MOSI  (via drill 0.38)
  Top 0.254: v20,11.5 20.25,11.25 U1.28
  Top 0.406: CN1.3 v17.5,3.5
  Bottom 0.254: v20,11.5 18.88,10.38 18.88,7.62 17.5,6.25 v17.5,3.5
SPI_NSS  (via drill 0.38)
  Top 0.254: v23.88,9.75 U1.25
  Top 0.406: CN1.6 v20.5,3.5
  Bottom 0.305: v23.88,9.75 20.5,6.38 v20.5,3.5
SPI_SCK  (via drill 0.38)
  Top 0.254: v23.38,10.75 22.88,10.25 U1.26
  Top 0.406: CN1.5 v19.5,3.5
  Bottom 0.254: v23.38,10.75 23.38,10.25 19.5,6.38 v19.5,3.5
STATUS  (via drill 0.38)
  Top 0.254: v13.75,8.62 14.12,8.25 U1.13
  Top 0.406: R6.1 4.38,7.28 v4.38,7.5
  Bottom 0.305: v4.38,7.5 5.5,8.62 v13.75,8.62
TCLK
  Top 0.254: JTAG.4 28.28,10.5 27.5,10.5 25.62,12.38 25.62,16 24.75,16.88 20.5,16.88 U1.37
TDI  (via drill 0.38)
  Top 0.254: U1.38 19.88,15.5 v20.25,15.12 | JTAG.8 27.48,13.02 26.38,14.12 v26.38,16
  Bottom 0.305: v20.25,15.12 25.5,15.12 v26.38,16
TDO  (via drill 0.38)
  Top 0.254: U1.39 19.38,14.88 v20.25,14 | JTAG.6 27.5,11.75 26.38,12.88 v26.38,13.12
  Bottom 0.305: v26.38,13.12 25.5,14 v20.25,14
TMS
  Top 0.254: U1.34 22.75,14.25 23.25,13.75 23.25,12.75 26.75,9.25 28.26,9.25 JTAG.2
USART3_RX  (via drill 0.38)
  Top 0.254: U1.22 19.38,10.25 v16.62,13
  Top 0.305: v13.38,16.38 12.88,15.88 10.88,15.88 9.62,17.12 5.25,17.12 2.75,14.62 CN2.1
  Bottom 0.305: v16.62,13 13.38,16.25 v13.38,16.38
USART3_TX  (via drill 0.38)
  Top 0.254: U1.21 18.88,9.38 v16,12.25
  Top 0.305: v12.25,16.62 11.38,16.62 10.25,17.75 3.71,17.75 CN2.2
  Bottom 0.305: v16,12.25 12.25,16 v12.25,16.62
XY_TEMP  (via drill 0.38)
  Top 0.254: v15.62,6.75 16.38,7.5 U1.16 | v25,26 24.75,25.75 U2.23
  Bottom 0.254: v15.62,6.75 17.62,8.75 17.62,10.88 18.62,11.88 18.62,16 21.62,19 21.62,22.62 v25,26
Z_TEMP  (via drill 0.38)
  Top 0.254: v25.88,8.38 23.75,6.25 22,6.25 21.75,6.5 18.62,6.5 17.88,7.25 U1.19 | v30.75,25.62 U5.23
  Bottom 0.305: v25.88,8.38 33.5,16 33.5,22.88 v30.75,25.62

### Text on the board
Bottom: AP '10
Document: Angus Peart
_tsilk: GND | 5v | TX | RX | Version 1.3